# Altium schematic sheet Microcontroller.SchDoc
size A4; SheetNumber: 5; SheetTotal: 7
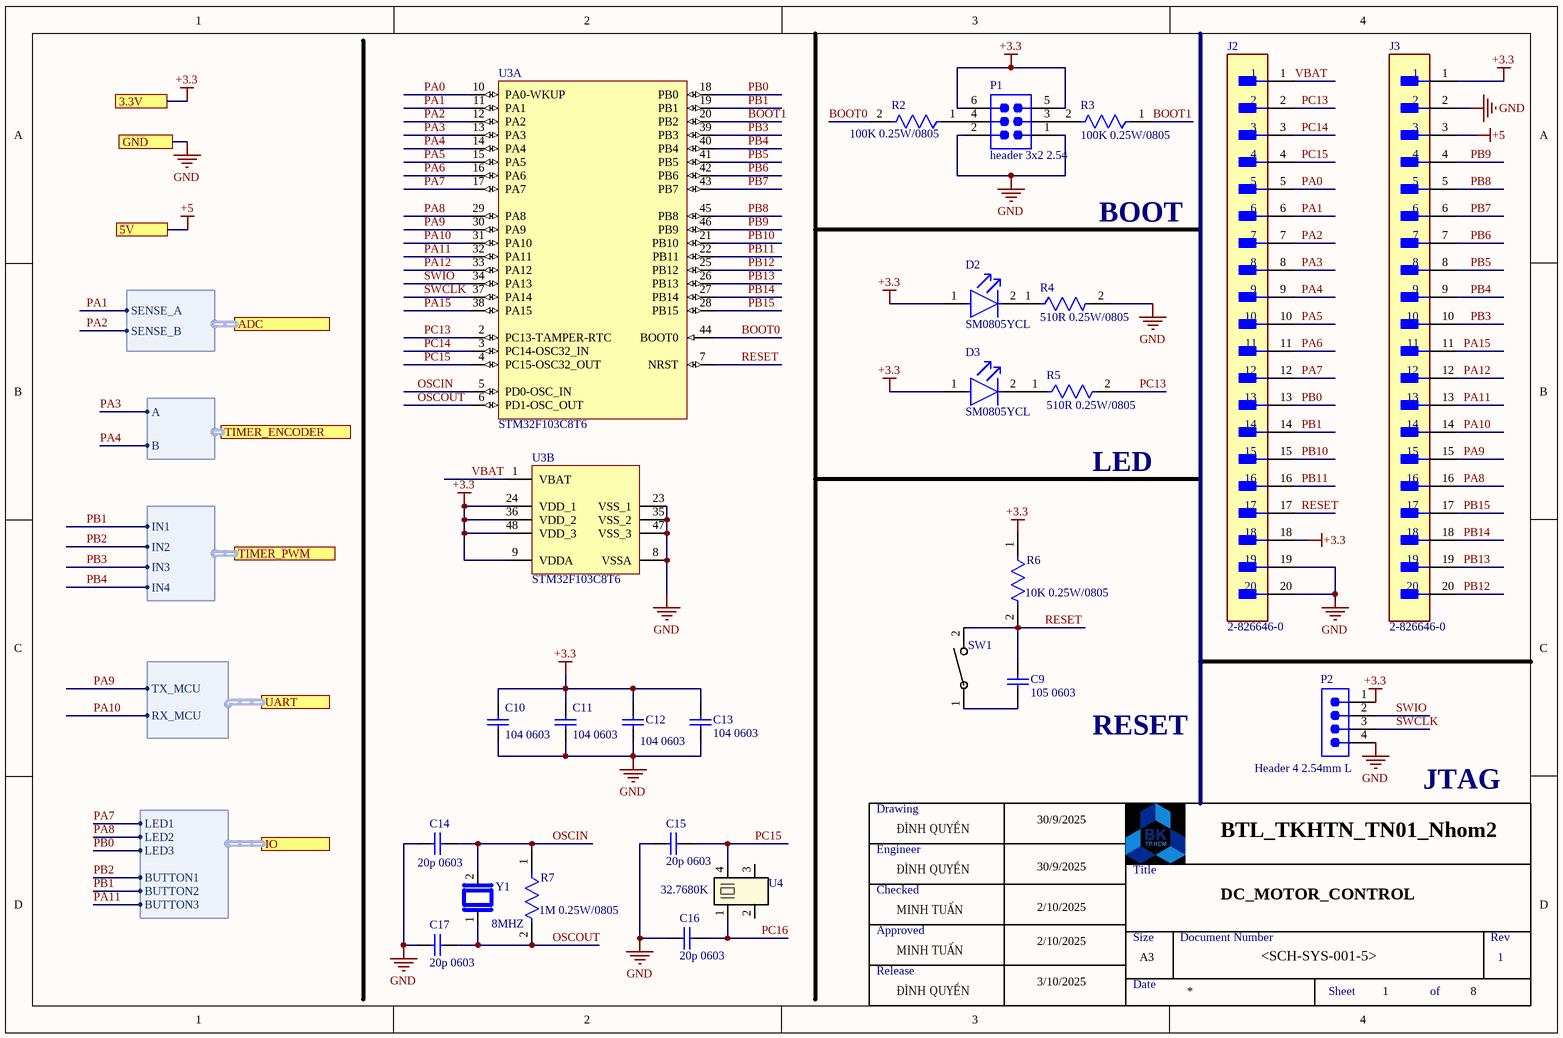
[diagram p0: Microcontroller.SchDoc]

## Parts
C9  105 0603  [CAPC1608X92X38ML15T08]
C10  104 0603  [CAPC1608X92X38ML15T08]
C11  104 0603  [CAPC1608X92X38ML15T08]
C12  104 0603  [CAPC1608X92X38ML15T08]
C13  104 0603  [CAPC1608X92X38ML15T08]
C14  20p 0603  [CAPC1608X92X38ML15T08]
C15  20p 0603  [CAPC1608X92X38ML15T08]
C16  20p 0603  [CAPC1608X92X38ML15T08]
C17  20p 0603  [CAPC1608X92X38ML15T08]
D2  SM0805YCL  [FP-SM0805YCL-MFG]
D3  SM0805YCL  [FP-SM0805YCL-MFG]
J2  2-826646-0  [FP-2-826646-0-MFG]
J3  2-826646-0  [FP-2-826646-0-MFG]
P1  header 3x2 2.54  [SMTC-TSW-103-08-X-D]
P2  Header 4 2.54mm L  [SMTC-TSW-104-08-X-S]
R2  100K 0.25W/0805  [FP-AF0805-IPC_C]
R3  100K 0.25W/0805  [FP-AF0805-IPC_C]
R4  510R 0.25W/0805  [FP-AF0805-IPC_C]
R5  510R 0.25W/0805  [FP-AF0805-IPC_C]
R6  10K 0.25W/0805  [FP-AF0805-IPC_C]
R7  1M 0.25W/0805  [FP-AF0805-IPC_C]
SW1  PTS636 SM50J SMTR LFS  [SW_PTS636_CNK]  (value not drawn)
U3  STM32F103C8T6  [STM-LQFP48_L]  (parts A,B of 2)
U4  32.7680K  [SOJ_MC-306_EPS]
Y1  8MHZ  [XTAL_HC49P488W43L1150T466H350]

## Ports
3.3V (see DC_MOTOR_CONTROLLER[3B], 78M05_RT9193[2A], Led_Button[1A], UART_CH340G[1A]), 5V (see DC_MOTOR_CONTROLLER[3B], 78M05_RT9193[2A], L298N_Motor[1C]), ADC (harness ADC, see DC_MOTOR_CONTROLLER[2B], L298N_Motor[2C]), GND (see DC_MOTOR_CONTROLLER[3B], 78M05_RT9193[2A], L298N_Motor[1C], Led_Button[1A], UART_CH340G[1A]), IO (harness LED_BUTTON, see DC_MOTOR_CONTROLLER[2B], Led_Button[1B]), TIMER_ENCODER (harness encoder, see DC_MOTOR_CONTROLLER[2B], L298N_Motor[2D]), TIMER_PWM (harness PWM, see DC_MOTOR_CONTROLLER[2B], L298N_Motor[2D]), UART (harness UART, see DC_MOTOR_CONTROLLER[3B], UART_CH340G[1B])

## Harnesses
UART: TX_MCU, RX_MCU
encoder: A, B
ADC: SENSE_B, SENSE_A
LED_BUTTON: LED1, LED2, BUTTON1, BUTTON2, BUTTON3, LED3
PWM: IN1, IN2, IN3, IN4

## Nets
+3.3: C10.2 C11.2 C12.2 C13.2 D2.1(A) D3.1(A) J2.18 J3.1 P1.5 P1.6 P2.1 R6.1 U3.9(VDDA) U3.24(VDD_1) U3.36(VDD_2) U3.48(VDD_3) ; port 3.3V
+5: J3.3 ; port 5V
GND: C10.1 C11.1 C12.1 C13.1 C14.2 C15.2 C16.2 C17.2 J2.19 J2.20 J3.2 P1.1 P1.2 P2.4 R4.2 U3.8(VSSA) U3.23(VSS_1) U3.35(VSS_2) U3.47(VSS_3) ; port GND
BOOT0: R2.2 U3.44(BOOT0)
BOOT1: R3.1 U3.20(PB2)
OSCIN: C14.1 R7.1 U3.5(PD0-OSC_IN) Y1.2
OSCOUT: C17.1 R7.2 U3.6(PD1-OSC_OUT) Y1.1
PA0: J2.5 U3.10(PA0-WKUP)
PA1: J2.6 U3.11(PA1) ; port ADC.SENSE_A
PA2: J2.7 U3.12(PA2) ; port ADC.SENSE_B
PA3: J2.8 U3.13(PA3) ; port TIMER_ENCODER.A
PA4: J2.9 U3.14(PA4) ; port TIMER_ENCODER.B
PA5: J2.10 U3.15(PA5)
PA6: J2.11 U3.16(PA6)
PA7: J2.12 U3.17(PA7) ; port IO.LED1
PA8: J3.16 U3.29(PA8) ; port IO.LED2
PA9: J3.15 U3.30(PA9) ; port UART.TX_MCU
PA10: J3.14 U3.31(PA10) ; port UART.RX_MCU
PA11: J3.13 U3.32(PA11) ; port IO.BUTTON3
PA12: J3.12 U3.33(PA12)
PA15: J3.11 U3.38(PA15)
PB0: J2.13 U3.18(PB0) ; port IO.LED3
PB1: J2.14 U3.19(PB1) ; port IO.BUTTON2, port TIMER_PWM.IN1
PB2: port IO.BUTTON1, port TIMER_PWM.IN2
PB3: J3.10 U3.39(PB3) ; port TIMER_PWM.IN3
PB4: J3.9 U3.40(PB4) ; port TIMER_PWM.IN4
PB5: J3.8 U3.41(PB5)
PB6: J3.7 U3.42(PB6)
PB7: J3.6 U3.43(PB7)
PB8: J3.5 U3.45(PB8)
PB9: J3.4 U3.46(PB9)
PB10: J2.15 U3.21(PB10)
PB11: J2.16 U3.22(PB11)
PB12: J3.20 U3.25(PB12)
PB13: J3.19 U3.26(PB13)
PB14: J3.18 U3.27(PB14)
PB15: J3.17 U3.28(PB15)
PC13: J2.2 R5.2 U3.2(PC13-TAMPER-RTC)
PC14: J2.3 U3.3(PC14-OSC32_IN)
PC15: C15.1 J2.4 U3.4(PC15-OSC32_OUT) U4.4
PC16: C16.1 U4.1
RESET: C9.2 J2.17 R6.2 SW1.2 U3.7(NRST)
SWCLK: P2.3 U3.37(PA14)
SWIO: P2.2 U3.34(PA13)
VBAT: J2.1 U3.1(VBAT)
NetC9_1: C9.1 SW1.1
NetD3_2: D3.2(C) R5.1
NetP1_3: P1.3 R3.2
NetP1_4: P1.4 R2.1

Not connected (* = marked no-connect by the designer): D2 2(C); R4 1; U4 2 3

## Notes on the sheet
- BOOT
- LED
- RESET
- JTAG
- Drawing
- Engineer
- ĐÌNH QUYỀN
- 30/9/2025
- BTL_TKHTN_TN01_Nhom2
- Checked
- MINH TUẤN
- 2/10/2025
- Title
- DC_MOTOR_CONTROL
- Approved
- Release
- 3/10/2025
- Size
- Date
- A3
- Document Number
- <SCH-SYS-001-5>
- Rev
- 1
- Sheet
- of
- 8

## Library data of the parts
C9-C17 = CMP-2006-01201-1: Manufacturer: Vitramon; Part Number: VJ0603Y103JXXAC
D2 D3 = CMP-35283-000007-1: LED YELLOW CLEAR 0805 SMD; Luminous Intensity: 11.5mcd; Test Current: 2mA; Viewing Angle: 130°; Dominant Wavelength: 592nm; Forward Voltage: 1.9V; Lens Color: Colorless; Case Code (Metric): 2012; Illumination Color: Yellow; Length: 2mm; Max Operating Temperature: 80°C; Width: 1.2mm; Case Code (Imperial): 0805; Packaging: Tape and Reel; Lens Transparency: Clear; Mount: Surface Mount; Case/Package: 0805; Forward Current: 2mA; Height: 0.8mm; Lead Free: Lead Free; Min Operating Temperature: -30°C; Color: Yellow; Package Quantity: 4000
J2 J3 = CMP-03369-000139-1: CONN HEADER VERT 20POS 2.54MM; Mating Connector Lock: No (Without); High Temperature Housing: No; Current Rating: 3A; Number of Positions: 20; PCB Mounting Orientation: Vertical; Connector Type: Plug; PCB Mount Retention: Without; Plating Thickness: 0.8um; Contact Post Length: 0.1259inch; Selectively Loaded: No (Without); Series: AMPMODU MOD II; Number of Rows: 1; Housing Color: Green; Mount: Straddle Mount; Max Operating Temperature: 105°C; Packaging: Carton; Row Spacing: 2.54mm; Board Standoff: No (Without); RoHS Compliant: Yes; Orientation: Straight; Contact Protection: No (Without); Strain Relief: No (Without); Keyed: No; Radiation Hardening: No; Package Quantity: 300; Contact Mating Length: 5.8mm; Termination: Through Hole; Contact Shape: Square; Length: 50.8mm; Pitch: 2.54mm; Stabilizers: No (Without); Gasket: No (Without); Number of Contacts: 20; Contact Gender: Male; Mating Alignment: No (Without); Min Operating Temperature: -65°C; Contact Type: Male Pin; Contact Plating: Gold; Flammability Rating: UL94 V-0; Housing Material: PBT; Color: Green; High Speed Serial Data Connector: No; Depth: 2.5mm; ELV: Compliant; Contact Material: Bronze
P1 = CMP-1024-00337-1: 0.025" SQ Post Header, Through-hole, Vertical, -55 to 125 degC, 2.54 mm Pitch, 6-Pin, Male, RoHS; Manufacturer: Samtec; PartNumber: TSW-103-08-F-D; Pitch: 2.54 mm; ComponentLink1URL: http://www.samtec.com; PackageReference: TSW-103-08-X-D; ComponentLink3Description: Package Specification; PackageDescription: .025[0.64] SQ. Post Terminal Strip Assembly; DatasheetVersion: F-214; ComponentLink1Description: Manufacturer URL; ComponentLink2Description: Datasheet; ComponentLink2URL: http://www.samtec.com/documents/webfiles/pdf/TSW_TH.PDF; PackageVersion: DM, 8/1988; Orientation: Vertical; Mounting Technology: Through-hole; RoHS: True; Temperature Range: -55 to 125 degC; ComponentLink3URL: http://www.samtec.com/documents/webfiles/cpdf/TSW-XXX-XX-XXX-X-XX-XXX-MKT.pdf
P2 = CMP-1024-00357-1: 0.025" SQ Post Header, Through-hole, Vertical, -55 to 125 degC, 2.54 mm Pitch, 4-Pin, Male, RoHS; Manufacturer: Samtec; PartNumber: TSW-104-08-G-S; RoHS: True; ComponentLink3URL: http://www.samtec.com/documents/webfiles/cpdf/TSW-XXX-XX-XXX-X-XX-XXX-MKT.pdf; Mounting Technology: Through-hole; ComponentLink2URL: http://www.samtec.com/documents/webfiles/pdf/TSW_TH.PDF; ComponentLink1URL: http://www.samtec.com; ComponentLink3Description: Package Specification; Pitch: 2.54 mm; PackageVersion: DM, 8/1988; ComponentLink2Description: Datasheet; PackageReference: TSW-104-08-X-S; PackageDescription: .025[0.64] SQ. Post Terminal Strip Assembly; ComponentLink1Description: Manufacturer URL; Temperature Range: -55 to 125 degC; DatasheetVersion: F-214; Orientation: Vertical
R2-R7 = CMP-03412-045285-1: Anti-Sulfurated Chip Resistor Automotive Grade 75Ω 1% 0.125W ±100ppm/°C 0805; Max Power Dissipation: 125mW; Resistance: 75R; Resistor Type: Thick Film; Number of Terminations: 2; Min Operating Temperature: -55°C; Packaging: Tape and Reel; Height: 0.024inch; Max Operating Temperature: 155°C; Series: AF; Case/Package: 0805; Tolerance: 1%; Length: 0.079inch; Width: 0.049inch; Features: Moisture Resistant; RoHS Compliant: Yes; Temperature Coefficient: 100ppm/°C
SW1 = PTS636 SM50J SMTR LFS: No Description Available; Manufacturer_Name: C&K Components; Type: Tactile Switches; Copyright: Copyright (C) 2025 Ultra Librarian. All rights reserved.; Manufacturer_Part_Number: PTS636 SM50J SMTR LFS
U3 = CMP-0237-00215-3: ARM Cortex-M3 32-bit MCU, 64 KB Flash, 20 KB Internal RAM, 37 I/Os, 48-pin LQFP, -40 to 85 degC, Tray; Supply Voltage(Vcc) min (V): 2; Internal RAM Size (kB): 20; FLASH Size (Prog) (kB): 64; A/D Converter: 2x12-bit (10 Channel); I/Os (High Current): 37; Operating Frequency(F) (Processor speed) (MHz): 72; Core: ARM Cortex-M3; ComponentLink3Description: Package Specification; Mounting Technology: Surface Mount; PartNumber: STM32F103C8T6; PackageReference: LQFP48; Packing: Tray; ComponentLink3URL: http://www.st.com/st-web-ui/static/active/en/resource/technical/document/datasheet/DM00058181.pdf; DatasheetVersion: Rev. 16; ComponentLink1URL: http://www.st.com/web/en/home.html; PackageVersion: Rev. 6, 06/2013; ComponentLink2URL: http://www.st.com/st-web-ui/static/active/en/resource/technical/document/datasheet/CD00161566.pdf; ComponentLink1Description: Manufacturer URL; ComponentLink2Description: Datasheet; PackageDescription: 48-Pin Low Profile Quad Flat Package, 7 x 7 mm Body, 0.5 mm Pitch
U4 = MC-306 32.7680K-A3: ROHS: No Description Available; Manufacturer_Name: Epson; Copyright: Copyright (C) 2025 Ultra Librarian. All rights reserved.; Manufacturer_Part_Number: MC-306 32.7680K-A3: ROHS; RefDes: RefDes; Type: Type
Y1 = HC-49/U-S16000000ABJB: 16 MHz Â±30ppm Crystal 18pF 50 Ohms HC-49/US; MF: Citizen Finedevice; SnapEDA_Link: https://www.snapeda.com/parts/HC-49/U-S16000000ABJB/Citizen/view-part/?ref=snap; Package: HC-49/US Citizen Finetech Miyota; Value: *; MP: HC-49/U-S16000000ABJB; Check_prices: https://www.snapeda.com/parts/HC-49/U-S16000000ABJB/Citizen/view-part/?ref=eda